# EAGLE board Evaluation_Board_v1.0 (EAGLE 9.6.2)
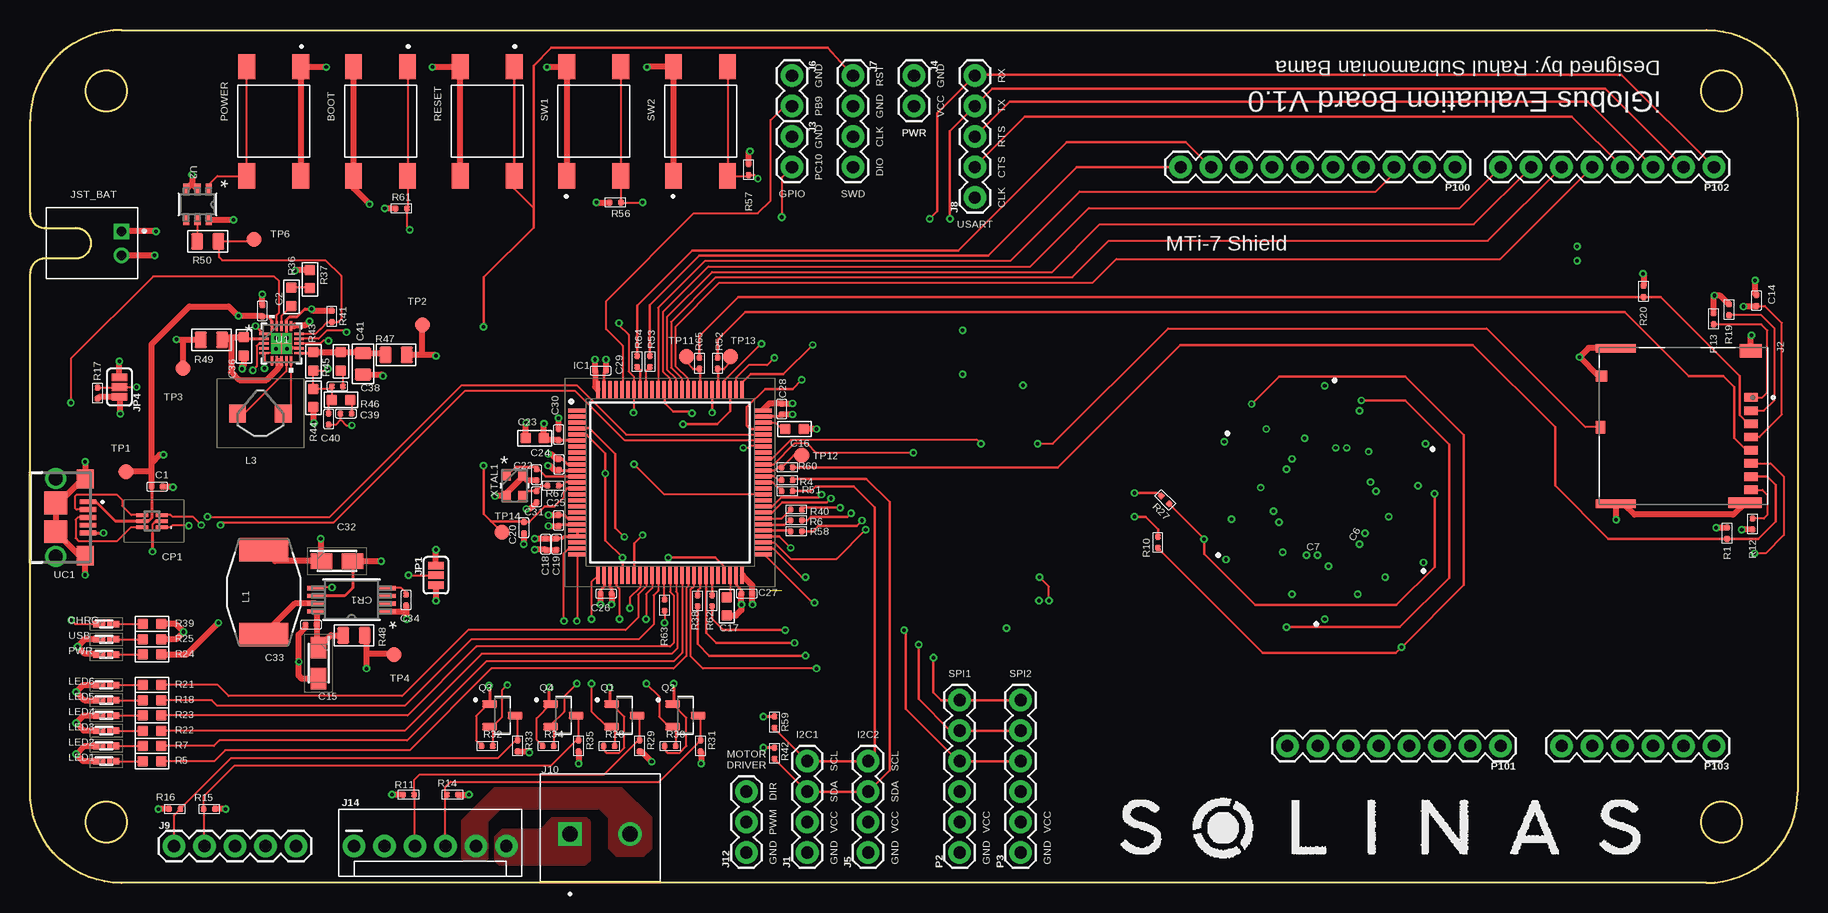
[diagram p3: board, top side]
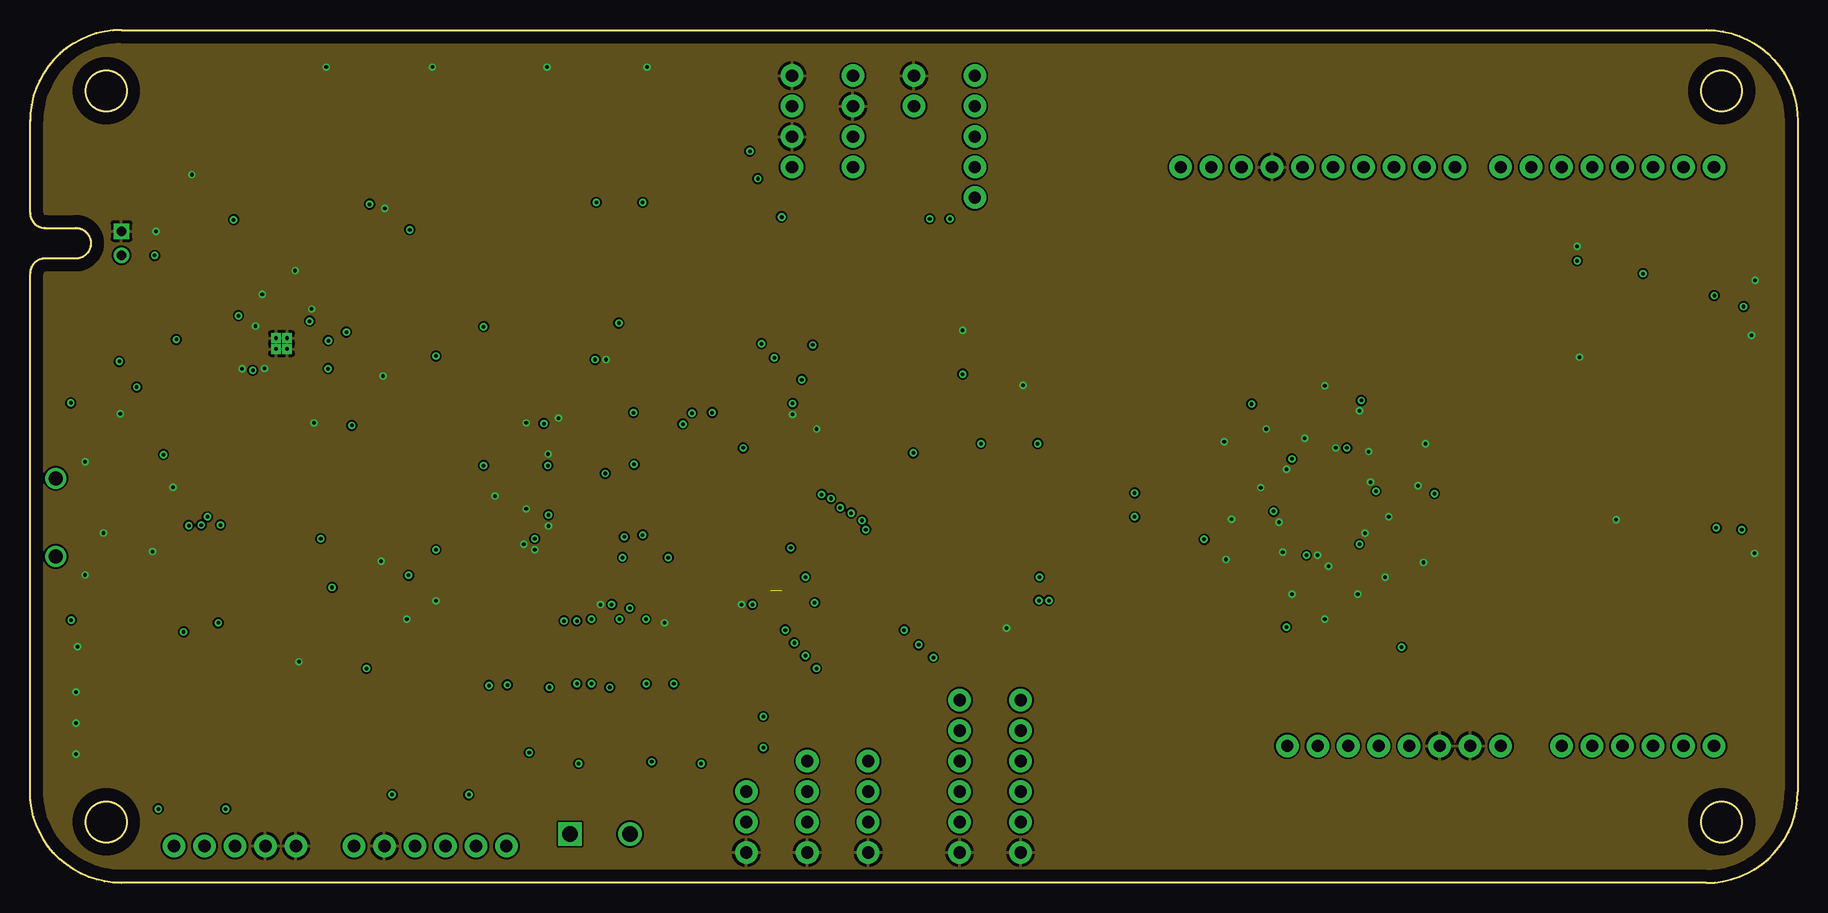
[diagram p4: board, inner layer Route2]
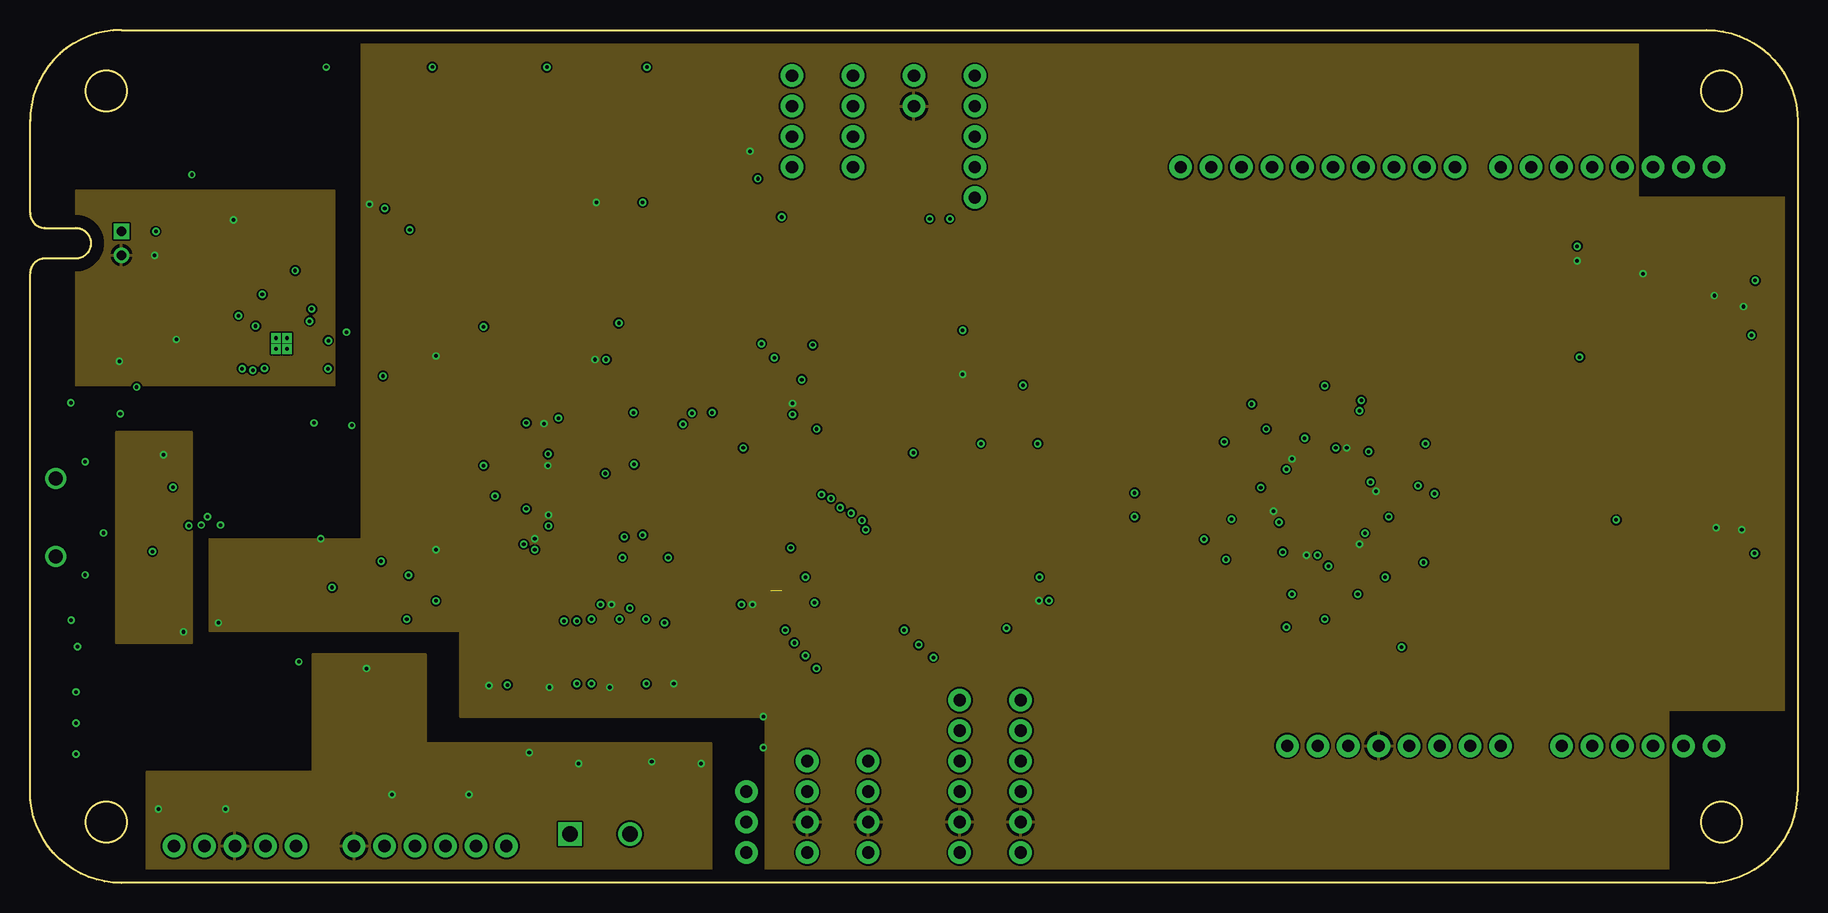
[diagram p5: board, inner layer Route15]
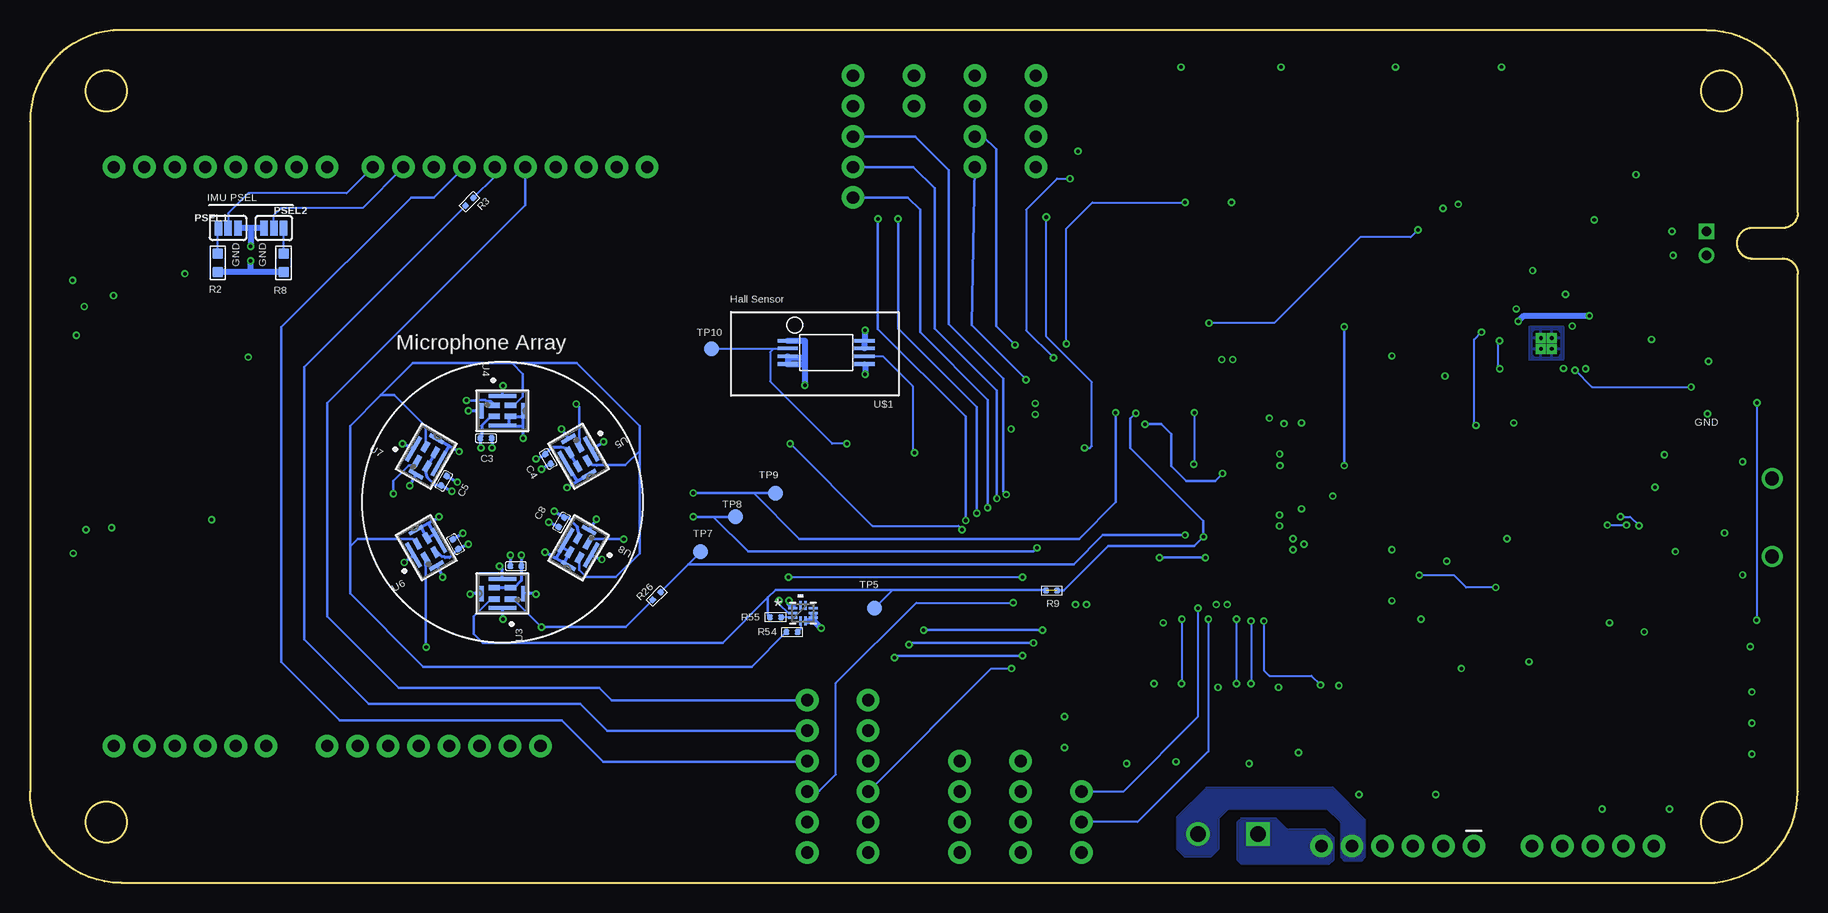
[diagram p6: board, bottom side, seen from below]

Size 147.32 x 71.12 mm. Coordinates in mm from the lower left corner, seen from the top.
Outline: 0,63.5 arc-90 7.62,71.12 139.7,71.12 arc-90 147.32,63.5 147.32,7.62 arc-90 139.7,0 7.62,0 arc-90 0,7.62 0,50.8 arc-90 1.27,52.07 3.81,52.07 arc90 5.08,53.34 arc90 3.81,54.61 1.27,54.61 arc-90 0,55.88 0,63.6
Outline: circle at 6.35,5.08 radius 1.7
Outline: circle at 6.35,66.04 radius 1.7
Outline: circle at 140.97,66.04 radius 1.7
Outline: circle at 140.97,5.08 radius 1.7
Copper layers (1+2*15+16): Top 0.035mm / dielectric 0.11mm / Route2 0.035mm / dielectric 0.4mm / Route15 0.035mm / dielectric 0.11mm / Bottom 0.035mm
Design rules "default *": minimum track width 6mil, minimum drill 0.3mm, track to track 6mil, track to pad 6mil, pad to pad 6mil, via to via 6mil, smd to smd 6mil, copper to edge 40mil, drill to drill 10mil, minimum pad ring 10mil, minimum via ring 6mil, stop-mask expansion 4mil, vias tented up to drill 0mil, thermal gap 10mil
Net classes: 1 Impedance Match: width 0.203 mm; 2 Power: width 0.152 mm; 3 High Power: width 0.762 mm; 4 Differential Impedance: width 0.152 mm, clearance 0.152 mm
tKeepout: area 138.2,2.3 to 143.7,7.8; area 138.2,63.3 to 143.7,68.8; area 3.6,63.3 to 9.1,68.8
bKeepout: area 3.6,2.3 to 9.1,7.8; area 138.2,2.3 to 143.7,7.8; area 138.2,63.3 to 143.7,68.8; area 3.6,63.3 to 9.1,68.8
tRestrict: area 3.6,2.3 to 9.1,7.8; area 138.2,2.3 to 143.7,7.8; area 138.2,63.3 to 143.7,68.8; area 3.6,63.3 to 9.1,68.8; area 3.6,2.3 to 9.1,7.8
bRestrict: area 138.2,2.3 to 143.7,7.8; area 138.2,63.3 to 143.7,68.8; area 3.6,2.3 to 9.1,7.8; area 3.6,63.3 to 9.1,68.8

## Footprints (pad centres in the part's own frame; a part is rotated, then mirrored left to right if it is on the bottom)
SW_1571563-2 = smd 2.1 x 1.4: 1 -4.55,2.25; 2 4.55,2.25; 3 -4.55,-2.25; 4 4.55,-2.25
C0402 = smd 0.5 x 0.5: 1 0,0.463; 2 0,-0.463
CAPPM3216X180N = smd 1.8 x 1.3: 1 -1.3,0; 2 1.3,0
C0603 = smd 0.889 x 0.889: 1 0,0.762; 2 0,-0.762
C0805 = smd 1.397 x 1.016: 1 0,0.889; 2 0,-0.889
LEDM106X25N = smd 1 x 0.55: 1 -0.6,0; 2 0.6,0
USBLC62P6 = smd 0.3 x 0.99: 1 -0.5,-0.805; 2 0,-0.805; 3 0.5,-0.805; 4 0.5,0.805; 5 0,0.805; 6 -0.5,0.805
TSSOP8_STM = smd 1.473 x 0.356: 1 -2.946,0.975; 2 -2.946,0.325; 3 -2.946,-0.325; 4 -2.946,-0.975; 5 2.946,-0.975; 6 2.946,-0.325; 7 2.946,0.325; 8 2.946,0.975
QFP50P1600X1600X160-100N = smd 1.475 x 0.3: 1 -7.738,6; 2 -7.738,5.5; 3 -7.738,5; 4 -7.738,4.5; 5 -7.738,4; 6 -7.738,3.5; 7 -7.738,3; 8 -7.738,2.5; 9 -7.738,2; 10 -7.738,1.5; 11 -7.738,1; 12 -7.738,0.5; 13 -7.738,0; 14 -7.738,-0.5; 15 -7.738,-1; 16 -7.738,-1.5; 17 -7.738,-2; 18 -7.738,-2.5; 19 -7.738,-3; 20 -7.738,-3.5; 21 -7.738,-4; 22 -7.738,-4.5; 23 -7.738,-5; 24 -7.738,-5.5; 25 -7.738,-6; 51 7.738,-6; 52 7.738,-5.5; 53 7.738,-5; 54 7.738,-4.5; 55 7.738,-4; 56 7.738,-3.5; 57 7.738,-3; 58 7.738,-2.5; 59 7.738,-2; 60 7.738,-1.5; 61 7.738,-1; 62 7.738,-0.5; 63 7.738,0; 64 7.738,0.5; 65 7.738,1; 66 7.738,1.5; 67 7.738,2; 68 7.738,2.5; 69 7.738,3; 70 7.738,3.5; 71 7.738,4; 72 7.738,4.5; 73 7.738,5; 74 7.738,5.5; 75 7.738,6 | smd 0.3 x 1.475: 26 -6,-7.738; 27 -5.5,-7.738; 28 -5,-7.738; 29 -4.5,-7.738; 30 -4,-7.738; 31 -3.5,-7.738; 32 -3,-7.738; 33 -2.5,-7.738; 34 -2,-7.738; 35 -1.5,-7.738; 36 -1,-7.738; 37 -0.5,-7.738; 38 0,-7.738; 39 0.5,-7.738; 40 1,-7.738; 41 1.5,-7.738; 42 2,-7.738; 43 2.5,-7.738; 44 3,-7.738; 45 3.5,-7.738; 46 4,-7.738; 47 4.5,-7.738; 48 5,-7.738; 49 5.5,-7.738; 50 6,-7.738; 76 6,7.738; 77 5.5,7.738; 78 5,7.738; 79 4.5,7.738; 80 4,7.738; 81 3.5,7.738; 82 3,7.738; 83 2.5,7.738; 84 2,7.738; 85 1.5,7.738; 86 1,7.738; 87 0.5,7.738; 88 0,7.738; 89 -0.5,7.738; 90 -1,7.738; 91 -1.5,7.738; 92 -2,7.738; 93 -2.5,7.738; 94 -3,7.738; 95 -3.5,7.738; 96 -4,7.738; 97 -4.5,7.738; 98 -5,7.738; 99 -5.5,7.738; 100 -6,7.738
1X04 = drill 1.016 pad 1.88: 1 0,0; 2 2.54,0; 3 5.08,0; 4 7.62,0
MOLEX_503398-1892 = smd 0.7 x 1.1: 1 -2.38,5.625; 2 -1.28,5.625; 3 -0.18,5.625; 4 0.92,5.625; 5 2.02,5.625; 6 3.12,5.625; 7 4.22,5.625; 8 5.32,5.625 | smd 0.9 x 0.93: 9 -4.17,-6.84 | smd 1.05 x 0.78: 10 0.095,-6.915 | smd 1.14 x 1.83: P1 -6.26,5.61 | smd 0.86 x 2.8: P2 6.4,5.125 | smd 0.7 x 3.33: P3 -6.48,-5.64; P4 6.48,-5.64
1X02 = drill 1.016 pad 1.88: 1 0,0; 2 2.54,0
1X05 = drill 1.016 pad 1.88: 1 0,0; 2 2.54,0; 3 5.08,0; 4 7.62,0; 5 10.16,0
CUI_TB001-500-02BE = drill 1.3 square: 1 0,0 | drill 1.3: 2 5,0
1X03 = drill 1.016 pad 1.88: 1 0,0; 2 2.54,0; 3 5.08,0
MOLEX-1X6 = drill 1.016 pad 1.88: 1 0,0; 2 2.54,0; 3 5.08,0; 4 7.62,0; 5 10.16,0; 6 12.7,0
SMT-JUMPER_3_1-NC_PASTE_SILK = smd 0.635 x 1.27: 1 -0.813,0; 2 0,0; 3 0.813,0
JST_S2B-PH-K-S(LF)(SN) = drill 0.8 square: 1 -1,0 | drill 0.8: 2 1,0
INDM9060X500N = smd 1.956 x 4.089: 1 -3.531,0; 2 3.531,0
CDRH3D16HPNP2R2NC = smd 1.4 x 1.5: 1 -1.9,0; 2 1.9,0
QFN10_1P8X1P4X0P5_STM = smd 0.762 x 0.203: 1 -0.851,0.4; 2 -0.851,0; 3 -0.851,-0.4; 6 0.851,-0.4; 7 0.851,0; 8 0.851,0.4 | smd 0.203 x 0.762: 4 -0.2,-0.648; 5 0.2,-0.648; 9 0.2,0.648; 10 -0.2,0.648
1X06 = drill 1.016 pad 1.88: 1 0,0; 2 2.54,0; 3 5.08,0; 4 7.62,0; 5 10.16,0; 6 12.7,0
1X10 = drill 1.016 pad 1.88: 1 0,0; 2 2.54,0; 3 5.08,0; 4 7.62,0; 5 10.16,0; 6 12.7,0; 7 15.24,0; 8 17.78,0; 9 20.32,0; 10 22.86,0
1X08 = drill 1.016 pad 1.88: 1 0,0; 2 2.54,0; 3 5.08,0; 4 7.62,0; 5 10.16,0; 6 12.7,0; 7 15.24,0; 8 17.78,0
SOT95P240X111-3N = smd 1.23 x 0.6: 1 -1.06,0.95; 2 -1.06,-0.95; 3 1.06,0
R0402 = smd 0.5 x 0.5: 1 0,0.463; 2 0,-0.463
R0603 = smd 0.889 x 0.889: 1 0,0.762; 2 0,-0.762
R0805 = smd 1.397 x 1.016: 1 0,0.889; 2 0,-0.889
B1,27 = smd 1.27 x 1.27: TP 0,0
QFN-20_UD_LIT = smd 0.805 x 0.199: 1 -1.452,0.8; 2 -1.452,0.4; 3 -1.452,0; 4 -1.452,-0.4; 5 -1.452,-0.8; 11 1.452,-0.8; 12 1.452,-0.4; 13 1.452,0; 14 1.452,0.4; 15 1.452,0.8 | smd 0.199 x 0.805: 6 -0.8,-1.452; 7 -0.4,-1.452; 8 0,-1.452; 9 0.4,-1.452; 10 0.8,-1.452; 16 0.8,1.452; 17 0.4,1.452; 18 0,1.452; 19 -0.4,1.452; 20 -0.8,1.452 | smd 1.75 x 1.75: 21 0,0 | drill 0.3 square: P$1 -0.457,0.457; P$2 0.457,0.457; P$3 -0.457,-0.457; P$4 0.457,-0.457
21-0114C_MXM = smd 0.927 x 0.508: 1 -1.264,0.95; 2 -1.264,0; 3 -1.264,-0.95; 4 1.264,-0.95; 5 1.264,0; 6 1.264,0.95
SPK0641HT4H-1_KNO = smd 0.457 x 0.94: 1 -0.475,-0.675; 2 -0.475,0.675; 3 0.475,0.675; 4 0.475,-0.675 | smd 1.295 x 0.33: 5 0,-1.712; 7 0,1.712 | smd 0.33 x 2.311: 6 -1.212,0; 8 1.212,0
A1162-8 = smd 0.3 x 1.7: 1 0,-3.2; 2 0.65,-3.2; 3 1.3,-3.2; 4 1.95,-3.2; 5 1.95,3.2; 6 1.3,3.2; 7 0.65,3.2; 8 0,3.2
2013499-1 = smd 0.4 x 1.35: 1 -1.3,4.825; 2 -0.65,4.825; 3 0,4.825; 4 0.65,4.825; 5 1.3,4.825 | smd 1.6 x 1.4: 6 -3.2,4.6; 7 3.2,4.6 | smd 1.9 x 1.9: 8 -1.2,2.15; 9 1.2,2.15 | drill 1.15 pad 1.75: 10 -3.255,2.15; 11 3.255,2.15
NX2520SA_NDK = smd 0.66 x 0.813: 1 -0.65,0.838; 2 -0.65,-0.838; 3 0.65,-0.838; 4 0.65,0.838

## Placement (x,y rotation side)
BOOT  1571563-2  [SW_1571563-2]  29.21,63.5 270 top
C1  100nf  [C0402]  10.59,33.05 270 top
C2  1uf  [C0402]  19.35,47.7 0 top
C3  100nf  [C0402]  109.32,37.08 270 bottom
C4  100nf  [C0402]  104.14,35.36 210 bottom
C5  100nf  [C0402]  112.83,33.53 330 bottom
C6  100nf  [C0402]  111.86,28.24 30 bottom
C7  100nf  [C0402]  106.83,26.42 90 bottom
C8  100nf  [C0402]  103.02,30.07 150 bottom
C14  100nf  [C0402]  143.87,48.56 180 top
C15  TPSA476K006R0800  [CAPPM3216X180N]  24.05,18.33 270 top
C16  2.2uf  [C0603]  63.7,37.85 270 top
C17  2.2uf  [C0603]  58.06,23.06 180 top
C18  100nf  [C0402]  42.98,28.24 180 top
C19  1uf  [C0402]  43.89,28.24 180 top
C20  100nf  [C0402]  41.15,29.62 180 top
C22  10pf  [C0402]  42.21,34.04 180 top
C23  10uf  [C0603]  42.06,37.08 90 top
C24  100nf  [C0402]  44.07,34.9 0 top
C25  100nf  [C0402]  44.04,30.23 180 top
C26  100nf  [C0402]  48.01,24.13 90 top
C27  100nf  [C0402]  59.74,24.13 90 top
C28  100nf  [C0402]  62.64,39.52 180 top
C29  100nf  [C0402]  47.55,42.72 270 top
C30  100nf  [C0402]  44.04,37.39 0 top
C31  10pf  [C0402]  42.21,32.21 180 top
C32  TPSA476K006R0800  [CAPPM3216X180N]  25.58,26.84 0 top
C33  100nf  [C0402]  23.42,21.53 270 top
C34  100nf  [C0402]  31.34,23.59 180 top
C36  10uf  [C0603]  17.83,44.75 180 top
C38  33pf  [C0402]  25.62,41.4 90 top
C39  330pf  [C0402]  26.33,39.14 90 top
C40  10pf  [C0402]  24.89,38.68 180 top
C41  22uf  [C0805]  27.74,43.29 180 top
CHRG  SML-P12MTT86R  [LEDM106X25N]  6.35,21.59 0 top
CP1  USBLC6-2P6  [USBLC62P6]  10.16,30.18 90 top
CR1  L6920D  [TSSOP8_STM]  26.8,23.61 180 top
IC1  STM32F446VET6  [QFP50P1600X1600X160-100N]  53.34,33.39 0 top
J1  I2C_1  [1X04]  64.77,2.54 90 top
J2  503398-1892  [MOLEX_503398-1892]  137.79,38.1 270 top
J3  [1X02]  63.5,62.23 270 top
J4  [1X02]  73.66,67.31 270 top
J5  I2C_2  [1X04]  69.85,2.54 90 top
J6  [1X02]  63.5,67.31 270 top
J7  SWD  [1X04]  68.58,67.31 270 top
J8  USART  [1X05]  78.74,57.15 90 top
J9  ENCODER_2  [1X05]  12,3.08 0 top
J10  TB001-500-02BE  [CUI_TB001-500-02BE]  45,4.08 0 top
J12  MOTOR_DRIVER_2  [1X03]  59.69,2.54 90 top
J14  MOTOR_DRIVER_1  [MOLEX-1X6]  27,3.08 0 top
JP1  JUMPER-SMT_3_1-NC_PASTE_SILK  [SMT-JUMPER_3_1-NC_PASTE_SILK]  33.83,25.65 90 top
JP4  JUMPER-SMT_3_1-NC_PASTE_SILK  [SMT-JUMPER_3_1-NC_PASTE_SILK]  7.47,41.35 90 top
JST_BAT  S2B-PH-K-S(LF)(SN)  [JST_S2B-PH-K-S(LF)(SN)]  7.62,53.34 270 top
L1  UP1B-100-R  [INDM9060X500N]  19.48,24.25 270 top
L3  CDRH3D16_HPNP-2R2NC  [CDRH3D16HPNP2R2NC]  19.19,39.15 180 top
LED1  SML-P12MTT86R  [LEDM106X25N]  6.35,10.16 0 top
LED2  SML-P12MTT86R  [LEDM106X25N]  6.35,11.43 0 top
LED3  SML-P12MTT86R  [LEDM106X25N]  6.35,12.7 0 top
LED4  SML-P12MTT86R  [LEDM106X25N]  6.35,13.97 0 top
LED5  SML-P12MTT86R  [LEDM106X25N]  6.35,15.24 0 top
LED6  SML-P12MTT86R  [LEDM106X25N]  6.35,16.51 0 top
MUX1  AS21P2TLRQ  [QFN10_1P8X1P4X0P5_STM]  82.91,22.5 0 bottom
P2  SPI_1  [1X06]  77.47,2.54 90 top
P3  SPI_2  [1X06]  82.55,2.54 90 top
P100  IMU_TR  [1X10]  118.75,59.69 180 top
P101  IMU_TL  [1X08]  122.56,11.43 180 top
P102  IMU_BR  [1X08]  140.34,59.69 180 top
P103  IMU_BL  [1X06]  140.34,11.43 180 top
POWER  1571563-2  [SW_1571563-2]  20.32,63.5 270 top
PSEL1  JUMPER-SMT_3_1-NC_PASTE_SILK  [SMT-JUMPER_3_1-NC_PASTE_SILK]  130.81,54.61 180 bottom
PSEL2  JUMPER-SMT_3_1-NC_PASTE_SILK  [SMT-JUMPER_3_1-NC_PASTE_SILK]  127,54.61 0 bottom
PWR  SML-P12MTT86R  [LEDM106X25N]  6.35,19.05 0 top
Q1  BSS138  [SOT95P240X111-3N]  49.53,13.97 0 top
Q2  BSS138  [SOT95P240X111-3N]  54.61,13.97 0 top
Q3  BSS138  [SOT95P240X111-3N]  39.37,13.97 0 top
Q4  BSS138  [SOT95P240X111-3N]  44.45,13.97 0 top
R1  47k 1/16W  [R0402]  141.43,29.16 180 top
R2  1K  [R0603]  131.67,51.71 0 bottom
R3  22R  [R0402]  110.69,56.79 315 bottom
R4  22R  [R0402]  63.09,33.58 270 top
R5  560R  [R0603]  10.16,10.16 90 top
R6  22R  [R0402]  63.86,30.23 270 top
R7  560R  [R0603]  10.16,11.43 90 top
R8  1K  [R0603]  126.19,51.71 0 bottom
R9  22R  [R0402]  62.18,24.38 270 bottom
R10  22R  [R0402]  93.98,28.4 180 top
R11  4.7K  [R0402]  31.55,7.37 270 top
R12  47k 1/16W  [R0402]  143.56,29.92 0 top
R13  47k 1/16W  [R0402]  140.31,47.04 180 top
R14  4.7K  [R0402]  35.2,7.37 90 top
R15  4.7K  [R0402]  14.94,6.17 90 top
R16  4.7K  [R0402]  12.06,6.17 270 top
R17  47k 1/16W  [R0402]  5.64,40.84 180 top
R18  560R  [R0603]  10.16,15.24 90 top
R19  47k 1/16W  [R0402]  141.58,47.8 180 top
R20  47k 1/16W  [R0402]  134.47,49.33 180 top
R21  560R  [R0603]  10.16,16.51 90 top
R22  560R  [R0603]  10.16,12.7 90 top
R23  560R  [R0603]  10.16,13.97 90 top
R24  560R  [R0603]  10.16,19.05 90 top
R25  560R  [R0603]  10.16,20.32 90 top
R26  22R  [R0402]  95.1,23.93 135 bottom
R27  22R  [R0402]  94.59,31.95 225 top
R28  10K 1/16W  [R0402]  48.26,11.43 270 top
R29  10K 1/16W  [R0402]  50.8,11.43 0 top
R30  10K 1/16W  [R0402]  53.34,11.43 270 top
R31  10K 1/16W  [R0402]  55.88,11.43 0 top
R32  10K 1/16W  [R0402]  38.1,11.43 270 top
R33  10K 1/16W  [R0402]  40.64,11.43 0 top
R34  10K 1/16W  [R0402]  43.18,11.43 270 top
R35  10K 1/16W  [R0402]  45.72,11.43 0 top
R36  1K  [R0603]  21.78,48.87 180 top
R37  1K  [R0603]  23.33,50.34 180 top
R38  22R  [R0402]  55.63,23.52 180 top
R39  560R  [R0603]  10.16,21.59 90 top
R40  22R  [R0402]  63.86,31.14 270 top
R41  47k 1/16W  [R0402]  25.15,47.24 0 top
R42  10K 1/16W  [R0402]  62.03,10.82 180 top
R43  324K  [R0603]  23.62,43.48 180 top
R44  105K  [R0603]  23.62,40.44 180 top
R45  121K  [R0603]  25.91,43.48 180 top
R46  15K  [R0603]  25.91,40.28 270 top
R47  0R  [R0805]  30.51,44.04 90 top
R48  0R  [R0805]  27,20.64 90 top
R49  0R  [R0805]  15.12,45.29 270 top
R50  0R  [R0805]  14.81,53.49 90 top
R51  22R  [R0402]  63.09,32.66 270 top
R52  22R  [R0402]  57.3,43.33 180 top
R53  22R  [R0402]  51.66,43.48 180 top
R54  22R  [R0402]  83.82,20.93 270 bottom
R55  22R  [R0402]  85.19,22.15 270 bottom
R56  47k 1/16W  [R0402]  48.77,56.74 270 top
R57  47k 1/16W  [R0402]  59.89,59.49 180 top
R58  22R  [R0402]  63.86,29.31 270 top
R59  10K 1/16W  [R0402]  62.03,13.41 180 top
R60  22R  [R0402]  63.09,34.65 270 top
R61  10K 1/16W  [R0402]  30.94,56.24 90 top
R62  22R  [R0402]  56.85,23.52 180 top
R63  10K 1/16W  [R0402]  52.88,23.16 180 top
R64  22R  [R0402]  50.6,43.48 180 top
R65  22R  [R0402]  55.78,43.33 180 top
R67  0R  [R0402]  43.59,33.12 90 top
RESET  1571563-2  [SW_1571563-2]  38.1,63.5 270 top
SW1  1571563-2  [SW_1571563-2]  46.99,63.5 90 top
SW2  1571563-2  [SW_1571563-2]  55.88,63.5 90 top
TP1  TPB1,27  [B1,27]  7.98,34.29 0 top
TP2  TPB1,27  [B1,27]  32.69,46.53 0 top
TP3  TPB1,27  [B1,27]  12.76,42.92 0 top
TP4  TPB1,27  [B1,27]  30.35,19.02 180 top
TP5  TPB1,27  [B1,27]  76.96,22.91 0 bottom
TP6  TPB1,27  [B1,27]  18.67,53.67 0 top
TP7  TPB1,27  [B1,27]  91.44,27.64 0 bottom
TP8  TPB1,27  [B1,27]  88.54,30.53 0 bottom
TP9  TPB1,27  [B1,27]  85.19,32.51 0 bottom
TP10  TPB1,27  [B1,27]  90.53,44.55 0 bottom
TP11  TPB1,27  [B1,27]  54.71,43.89 0 top
TP12  TPB1,27  [B1,27]  64.31,35.66 0 top
TP13  TPB1,27  [B1,27]  58.37,43.89 0 top
TP14  TPB1,27  [B1,27]  39.32,29.26 0 top
U1  LTC3558EUDPBF  [QFN-20_UD_LIT]  20.96,44.98 0 top
U2  MAX16054AZT+T  [21-0114C_MXM]  13.95,56.57 270 top
U3  SPK0641HT4H-1  [SPK0641HT4H-1_KNO]  107.95,24.13 90 bottom
U4  SPK0641HT4H-1  [SPK0641HT4H-1_KNO]  107.95,39.37 270 bottom
U5  SPK0641HT4H-1  [SPK0641HT4H-1_KNO]  101.6,35.56 210 bottom
U6  SPK0641HT4H-1  [SPK0641HT4H-1_KNO]  114.3,27.94 30 bottom
U7  SPK0641HT4H-1  [SPK0641HT4H-1_KNO]  114.3,35.56 330 bottom
U8  SPK0641HT4H-1  [SPK0641HT4H-1_KNO]  101.6,27.94 150 bottom
U$1  A1162  [A1162-8]  80.98,45.21 270 bottom
U$2  [SOLINAS-LOGO]  90.17,1.27 0 top
UC1  2013499-1  [2013499-1]  0,30.48 270 top
USB  SML-P12MTT86R  [LEDM106X25N]  6.35,20.32 0 top
XTAL1  NX2520SA-16MHZ  [NX2520SA_NDK]  40.39,33.12 0 top

## Tracks (layer width: path | path; a pad name or v marks a point on that pad's centre or on a via)
BAT
  Top 0.152: C36.2 17.97,45.38
  Top 0.254: 17.97,45.38 U1.2 | U1.8 20.86,43.53 U1.7
  Top 0.508: 20.67,42.96 20.67,43.53 20.86,43.53 20.86,43.14 20.67,42.96 | 20.67,42.96 20.67,42.88 19.73,41.94 17.45,41.94 16.76,42.62 16.76,45.36 16.09,45.36 R49.1 16.24,45.52 C36.2
BOOT0  (via drill 0.3)
  Top 0.152: IC1.61 52.85,32.39 v50.34,34.9 | BOOT.1 BOOT.2 31.46,56.3 R61.2 31.4,54.71 v31.65,54.46 | v49.07,46.69 49.07,46.53 49.88,45.72 49.88,42.65 50.34,42.2 IC1.94 50.29,41.08 v50.29,39.22
  Bottom 0.152: v31.65,54.46 32.26,53.85 36.47,53.85 43.64,46.69 v49.07,46.69 | v50.29,39.22 50.29,34.95 v50.34,34.9
BOOT1
  Top 0.152: R63.2 52.84,23.67 IC1.37
DAC_OUT1  (via drill 0.3)
  Top 0.152: IC1.29 48.84,24.82 49.12,24.54 v49.12,22
  Bottom 0.152: v49.12,22 49.12,10.97 55.02,5.08 J12.2
DAT1
  Top 0.152: J2.8 144.36,32.78 144.78,32.36 144.78,30.68 144.48,30.38 R12.1
DAT2
  Top 0.152: J2.1 144.37,40.48 144.78,40.89 144.78,46.08 144.28,46.58 R13.1
DAT3
  Top 0.152: J2.2 144.49,39.38 145.39,40.28 145.39,46.23 144.28,47.34 R19.1
ENCODER_1A
  Top 0.152: Q1.3 50.8,13.76 R29.1 50.7,11.89 47.85,9.04 32.46,9.04 32.01,8.59 R11.1 32.08,7.29 J14.3
ENCODER_1B
  Top 0.152: Q2.3 55.88,13.76 R31.1 52.43,8.43 35.05,8.43 34.62,8 34.62,7.49 R14.1 34.62,7.24 J14.4
ENCODER_2A
  Top 0.152: Q3.3 40.64,13.76 R33.1 40.49,11.89 39.01,10.41 16.76,10.41 R16.1 12,5.64 J9.1
ENCODER_2B
  Top 0.152: Q4.3 45.72,13.76 R35.1 45.52,11.89 43.43,9.8 17.07,9.8 14.47,7.21 R15.1 14.54,6.11 J9.2
EXTI0_IRQN  (via drill 0.3)
  Top 0.152: IC1.35 51.84,24.59 51.33,24.08 v51.33,22 | v51.36,16.61 52.43,15.54 52.43,13.87 53.27,13.02 Q2.2 53.8,12.77 R30.1
  Bottom 0.152: v51.33,22 51.33,16.64 v51.36,16.61
EXTI1_IRQN  (via drill 0.3)
  Top 0.152: IC1.24 45.57,27.92 44.92,27.92 44.48,27.48 44.48,21.86 v44.5,21.84 | v39.78,16.51 39.32,16.05 39.32,13.82 38.52,13.02 Q3.2 38.56,12.77 R32.1
  Bottom 0.152: v44.5,21.84 44.5,17.73 44.04,17.27 40.54,17.27 v39.78,16.51
EXTI2_IRQN  (via drill 0.3)
  Top 0.152: IC1.25 45.6,21.88 v45.57,21.84 | v45.57,16.61 44.5,15.55 44.5,14.28 43.39,13.16 Q4.2 43.64,12.77 R34.1
  Bottom 0.152: v45.57,21.84 v45.57,16.61
EXTI3_IRQN  (via drill 0.3)
  Top 0.152: IC1.26 46.79,25.1 v46.79,22 | v46.79,16.61 46.79,14.33 48.09,13.02 Q1.2 48.72,12.77 R28.1
  Bottom 0.152: v46.79,22 v46.79,16.61
EXTI8_IRQN  (via drill 0.3)
  Top 0.152: IC1.67 61.86,35.39 63.4,36.93 78.94,36.93 v79.25,36.63
  Bottom 0.152: v79.25,36.63 80.47,36.63 85.65,41.81 85.65,44.25 85.34,44.55 | 85.34,44.55 U$1.2 | TP10.TP 85.34,44.55
EXTI11_IRQN  (via drill 0.3)
  Top 0.152: SW1.4 SW1.3 49.24,56.75 R56.1 v51.05,56.74 | IC1.79 57.81,41.16 57.81,41.83 60.94,44.96 v60.96,44.96
  Bottom 0.152: v51.05,56.74 58.78,56.74 60.96,54.56 v60.96,44.96
EXTI14_IRQN  (via drill 0.3)
  Top 0.152: IC1.53 62.03,28.39 63.4,27.03 67.21,27.03 v69.65,29.46 | v83.97,36.63 85.24,36.63 94.84,46.23 121.39,46.23 129.61,38.01 J2.10
  Bottom 0.152: v83.97,36.63 77.11,29.77 69.95,29.77 v69.65,29.46
EXTI15_IRQN  (via drill 0.3)
  Top 0.152: SW2.4 SW2.3 59.82,58.95 R57.1 60.36,59.02 v60.66,58.73 | IC1.77 58.84,42.13 59.89,43.18 61.42,43.18 v62.03,43.79
  Bottom 0.152: v60.66,58.73 61.72,58.73 64.31,56.13 64.31,46.08 v62.03,43.79
FMPI2C1_SCL
  Top 0.203: R51.1 65.07,32.66 65.46,33.06 68.65,33.06 70.41,31.29 70.41,10.72 J5.4 J1.4 62.03,12.9 R59.1
FMPI2C1_SDA
  Top 0.203: R4.1 63.56,33.69 69.7,33.69 71.63,31.76 71.63,9.4 J5.3 J1.3 R42.1
GND  (via drill 0.3)
  Top 0.152: 51.44,68.05 v51.41,68.02 | U1.5 20.16,44.18 U1.21 20.96,45.23 20.41,45.78 U1.1 19.45,45.78 19.44,45.79 | J2.6 145.06,34.98 146.15,33.88 146.15,29.01 144.63,27.48 v143.71,27.48 | 132.16,31.6 132.18,31.6 | C25.1 | CP1.2 10.93,30.21 10.5,30.21 10.21,29.92 10.21,29.16 | v13.49,59.05 13.54,59 | C18.1 | 22.68,68.02 22.6,68.02 POWER.1 | R63.1 v52.88,21.69
  Top 0.254: C25.1 44.17,29.89 IC1.20 | IC1.10 45.54,34.95 44.76,34.95 44.35,35.36 C24.1 | IC1.99 47.84,42.55 C29.1 | IC1.74 61.09,38.91 62.48,38.91 C28.1 | IC1.49 58.86,25.63 58.86,24.85 59.28,24.43 C27.1 | IC1.27 47.85,25.64 47.85,24.75 47.54,24.43 C26.1 | CR1.6 26.21,23.94 26.88,24.6 C32.2 | U1.12 21.36,44.58 20.98,44.96 | 20.98,44.96 U1.21 | 20.98,44.96 21.36,45.34 U1.17 21.36,46.93 21.67,47.23 22.28,47.23 22.9,47.85 v23.47,47.85 | v10.21,27.64 10.21,29.16 | UC1.5 v6.12,29.18 | v18.8,46.43 19.44,45.79 | J2.P4 132.44,31.6 | J2.P4 132.18,31.6 | J2.P4 132.18,31.57 | U1.5 19.53,44.16 v19.53,42.9
  Top 0.508: JP1.1 v33.83,23.52 | v7.52,39.12 7.47,39.17 JP4.1 5.8,40.54 R17.1 | v10.49,54.33 JST_BAT.1 | v24.69,68.02 22.68,68.02 | POWER.1 POWER.2 | U2.2 13.54,58.25 13.54,58.37 | U2.3 13.54,58.37 | 13.54,59 13.54,58.37 | RESET.4 RESET.3 35.82,68.02 v33.53,68.02 | SW1.1 SW1.2 43.11,68.05 v43.08,68.02 | SW2.1 SW2.2 51.44,68.05 | C41.1 29.28,42.4 v29.41,42.27 | R44.1 23.62,38.41 v23.67,38.35 | R37.2 22.15,51.11 v22.1,51.05 | C1.1 11.86,33.05 v11.91,32.99 | C36.1 17.83,43.22 17.68,43.07 v17.68,42.88 | C32.2 29.25,26.84 v29.26,26.82 | C33.2 22.96,21.27 22.39,20.7 22.39,18.45 | USB.1 4.57,20.32 v3.96,19.71 4.57,19.1 5.7,19.1 PWR.1 | LED6.1 4.42,16.51 v3.83,15.93 4.52,15.24 LED5.1 | LED4.1 4.47,13.97 v3.83,13.34 4.47,12.7 LED3.1 | LED2.1 4.52,11.43 v3.83,10.74 4.42,10.16 LED1.1 | C22.1 41.42,33.57 XTAL1.4 41.04,33.8 39.74,32.5 XTAL1.2 39.71,32.26 v38.76,32.26 | C31.1 41.66,31.19 v41.35,31.19 | UC1.6 4.6,33.88 | v4.6,25.68 UC1.7 4.15,27.28 UC1.9 UC1.8 2.39,31.68 4.6,33.88 | v4.6,35.13 4.6,33.88 | 132.44,31.6 132.83,31.6 133.72,30.71 141.93,30.71 J2.P2 | v132.18,30.28 132.18,31.57 132.16,31.6 | J2.P3 132.13,44.6 129.9,44.6 v129.13,43.84 130.7,42.27 J2.9 | J2.P1 143.41,45.62 v143.46,45.67 | C14.2 143.76,49.13 v143.76,50.24 | v65.56,37.85 C16.1 | C28.1 v63.55,39.06 | C29.1 v48.01,43.64 | C30.1 v44.04,38.76 | C23.1 41.3,38.3 v41.35,38.35 | v43.18,35.76 43.44,35.76 43.84,35.36 C24.1 | v43.2,29.77 C25.1 | C18.1 v42.06,27.79 | C18.1 C19.1 | C20.1 v41.15,28.25 | v47.55,23.22 v47.54,23.22 C26.1 | C27.1 v59.28,23.22 59.28,22.76 58.83,22.3 C17.1 | C15.2 22.64,17.03 22.39,17.29 22.39,18.45 | v22.4,18.44 22.39,18.45 | C34.1 31.34,22.45 | 31.34,22.45 31.34,22.05 v31.39,22
  Top 0.508: 31.34,22.45 31.16,22.64 CR1.1 | R61.1 v29.57,56.24 | C2.1 v19.36,49.07 | v23.47,47.85 23.62,47.7 R41.1
  Bottom 0.152: MUX1.7 82.06,22.4 | MUX1.6 82.06,21.91 82,21.86 | MUX1.5 82.6,21.86
  Bottom 0.254: C8.1 v104.09,30.07 | v107.29,27.33 C7.1 | v111.25,29.16 C6.1 | C5.1 v111.71,33.43 | C3.1 v108.81,36.27 | C4.1 v104.7,34.49 | U3.6 107.95,22.05 v107.9,22 | U3.7 110.59,24.13 v110.64,24.08 | U3.8 107.95,26.16 v108.2,26.42 | v105.16,24.08 105.21,24.13 U3.5 | U4.7 106.24,38.86 | 106.24,38.86 106.24,38.1 | 106.24,38.1 106.24,37.1 v106.22,37.08 | U4.8 107.89,38.1 107.44,38.1 | 107.44,38.1 106.24,38.1 | 107.44,38.1 107.44,38.73 U4.3 106.27,38.9 106.24,38.86 | U4.6 v107.9,41.45 | U4.5 v110.8,39.37 | U5.5 v103.02,37.85 | U5.6 v99.52,36.78 | U5.7 101.72,33.48 | 101.72,33.48 v102.56,32.97 | U5.8 101.72,33.48 | U7.7 112.38,36.44 | 112.38,36.44 v111.56,35.97 | U7.8 112.38,36.44 | U7.6 v116.28,36.63 | U7.5 v115.67,33.12 | U6.7 114.73,29.67 | 114.73,29.67 114.14,30.01 | 114.14,30.01 v113.23,30.53 | U6.8 113.58,29.08 | 113.58,29.08 114.14,30.01 | 114.73,29.67 U6.3 113.58,29.08 | U6.6 v116.13,26.72 | U6.5 v112.93,25.5 | U8.7 102.86,26.69 | 102.86,26.69 103.51,27.07 | 103.51,27.07 v104.39,27.58 | U8.8 102.97,28.01 | 102.97,28.01 103.51,27.07 | 102.97,28.01 U8.3 102.86,26.69 | U8.6 100.47,27.25 v99.67,26.98 | U8.5 v100.13,30.33
  Bottom 0.508: PSEL2.1 128.93,54.61 | 128.93,54.61 PSEL1.1 | 128.93,54.61 v128.93,53.09 | v81.38,21.23 82,21.86 | 82.6,21.86 82,21.86 | 82,21.86 82,22.35 82.06,22.4 | U$1.1 82.75,45.21 82.75,43.79 | 82.75,43.79 82.75,43.33 | 82.75,43.33 v82.75,41.5 | 82.75,43.33 82.82,43.26 U$1.4 U$1.3 84.05,43.79 82.75,43.79 | U$1.7 U$1.8 77.72,45.26 v77.72,46.08
  pour Route2 (isolate 0.127): -1.27,67.67 -1.27,-2.13 148.59,-2.13 148.59,67.31 142.75,73.15 4.22,73.15
  pour Bottom: 19.52,46.37 22.39,46.37 22.39,43.65 19.52,43.65
GPIO_PA10  (via drill 0.3, 0.35)
  Top 0.152: J3.2 62.64,58.83 v62.64,55.52 | IC1.69 61.05,36.42 60.05,36.42 59.89,36.27 v59.44,36.27
  Bottom 0.152: v59.44,36.27 58.98,36.27 58.83,36.42 58.83,41.76 62.64,45.57 v62.64,55.52
GPIO_PB9
  Top 0.152: IC1.96 49.38,41.17 49.38,44.8 48.01,46.17 48.01,48.51 55.32,55.83 60.66,55.83 61.72,56.9 61.72,63.6 62.89,64.77 J6.2
I2C1_SCL
  Top 0.203: R53.2 51.66,48.18 55.78,52.3 79.86,52.3 87.25,59.69 P100.10
I2C1_SDA
  Top 0.203: R64.2 50.6,48.16 55.17,52.73 77.37,52.73 86.41,61.77 96.32,61.77 98.4,59.69 P100.9
I2S1_CK  (via drill 0.3)  (1 unrouted)
  Top 0.203: v49.53,28.85 48.77,29.62 48.77,35.78 46.6,37.95 45.66,37.95 IC1.4 | IC1.89 52.88,41.09 52.88,40.04 53.6,39.32 55.02,39.32 v55.17,39.17
  Bottom 0.203: TP5.TP 75.44,24.43 | 75.44,24.43 85.19,24.43 85.84,23.79 | R55.2 85.84,22.33 85.84,23.79 | 85.84,23.79 89.61,20.02 109.58,20.02 110.34,20.78 110.34,22.23 108.92,23.66 U3.2 | v55.17,39.17 55.63,38.71 55.63,36.27 49.53,30.18 v49.53,28.85 50.29,28.09 57.45,28.09 61.16,24.38 R9.1 | 75.44,24.43 62.69,24.43 R9.2
I2S1_SD  (via drill 0.3)
  Top 0.203: IC1.32 50.34,28.29 v51.05,29.01
  Bottom 0.203: 92.46,26.57 91.42,27.61 TP7.TP | v51.05,29.01 57.91,29.01 60.35,26.57 92.46,26.57 | 92.46,26.57 R26.2
I2S2_SD  (via drill 0.3)
  Top 0.203: IC1.54 62.45,28.89 v63.4,27.94 | v92.05,30.53 92.96,30.53 94.03,29.46 94.03,28.91 R10.2
  Bottom 0.203: 90.37,30.53 87.48,27.64 63.7,27.64 v63.4,27.94 | v92.05,30.53 90.37,30.53 | TP8.TP 90.37,30.53
I2S3_SD  (via drill 0.3)
  Top 0.203: IC1.81 56.84,39.83 56.84,39.82 v56.84,39.22 | R27.2 94.03,32.51 v92.05,32.51
  Bottom 0.203: v56.84,39.22 56.84,31.75 59.89,28.7 83.21,28.7 87.02,32.51 | 87.02,32.51 TP9.TP | v92.05,32.51 87.02,32.51
I2SX_CK
  Bottom 0.203: 120.65,28.04 120.02,28.67 115.86,28.67 115.82,28.69 115.75,28.67 115.43,28.67 U6.2 | 96.52,36.02 96.52,38.1 101.75,43.33 107.14,43.33 | 96.52,36.02 96.52,27.48 98.5,25.5 100.95,25.5 101.55,26.1 101.55,26.23 101.54,26.24 101.54,26.25 101.54,27.1 U8.2 | 107.14,43.33 115.42,43.33 118.08,40.66 | 118.08,40.66 120.65,38.1 120.65,28.04 | 120.65,28.04 120.65,24.13 114.55,18.03 87.17,18.03 R54.2 | 118.08,40.66 116.97,40.66 114.35,38.05 114.35,37.27 114.36,37.26 114.36,37.25 114.36,36.4 U7.2 | 107.14,43.33 106.25,42.45 106.25,40.57 106.98,39.84 U4.2 | 96.52,36.02 97.71,34.83 100.05,34.83 100.08,34.81 100.15,34.83 100.47,34.83 U5.2
IMU_PSEL0
  Bottom 0.152: P100.2 119.61,56.29 126.4,56.29 127.04,55.64 127.04,54.65 PSEL2.2
IMU_PSEL1
  Bottom 0.152: P100.1 120.93,57.51 129.14,57.51 130.81,55.84 PSEL1.2
IMU_RESET
  Top 0.152: IC1.85 54.84,42.04 53.77,43.11 53.77,46.36 57.45,50.04 88.54,50.04 90.53,52.02 122.5,52.02 P102.5
IMU_SYNC_IN
  Top 0.152: IC1.88 53.34,42.04 52.73,42.65 52.73,47.6 56.54,51.41 83.36,51.41 88.24,56.29 119.15,56.29 P102.8
IMU_SYNC_OUT
  Top 0.152: IC1.87 53.84,42.04 53.08,42.81 53.08,47.19 56.84,50.95 85.19,50.95 89.15,54.91 120.32,54.91 P102.7
IMU_SYNC_PPS
  Top 0.152: IC1.86 54.34,42.04 53.43,42.96 53.43,46.77 57.15,50.49 86.87,50.49 89.92,53.54 121.49,53.54 P102.6
IO_LED1
  Top 0.152: IC1.41 54.84,24.74 54.69,24.59 54.69,18.92 53.65,17.88 38.46,17.88 31.65,11.07 16.26,11.07 15.34,10.16 R5.2
IO_LED2
  Top 0.152: IC1.40 54.34,19.19 53.65,18.49 38.03,18.49 31.42,11.89 15.77,11.89 15.32,11.43 R7.2
IO_LED3
  Top 0.152: IC1.39 53.84,24.28 53.95,24.17 53.95,19.56 53.49,19.1 37.63,19.1 31.23,12.7 R22.2
IO_LED4
  Top 0.152: IC1.38 53.34,24.28 53.65,23.98 53.65,20.02 53.34,19.71 37.2,19.71 31.46,13.97 R23.2
IO_LED5
  Top 0.152: IC1.36 52.34,24.35 51.97,23.98 51.97,21.54 50.75,20.32 36.78,20.32 31.25,14.78 15.62,14.78 15.16,15.24 R18.2
IO_LED6
  Top 0.152: IC1.34 51.34,24.72 50.67,24.05 50.67,22.12 49.63,21.08 36.5,21.08 31.02,15.6 16.56,15.6 15.65,16.51 R21.2
IO_MAG_DIAG  (via drill 0.3)
  Top 0.152: IC1.66 61.97,34.89 63.7,36.63 64.77,36.63 65.53,35.87 v73.61,35.87
  Bottom 0.152: v73.61,35.87 73.76,36.02 73.76,41.42 76.25,43.91 U$1.6
IO_MOTOR_DIR  (via drill 0.3)
  Top 0.152: IC1.33 50.84,24.65 49.99,23.8 v49.99,22.91
  Bottom 0.152: v49.99,22.91 49.99,13.87 56.24,7.62 J12.3
IO_MUX_MIC  (via drill 0.3)
  Top 0.152: IC1.52 61.92,27.89 64.31,25.5 v64.62,25.5 | v84.91,23.54 84.91,24.72 v84.12,25.5
  Bottom 0.152: v84.12,25.5 v64.62,25.5 | MUX1.2 83.81,22.45 84.11,22.45 84.91,23.25 v84.91,23.54
MODE  (via drill 0.3)
  Top 0.152: U1.3 19.09,44.98 18.88,44.77 18.88,43.06 v18.57,42.75 | JP4.2 7.62,41.35 | 7.62,41.35 v8.89,41.35 | R17.2 7.57,41.31 7.62,41.35
  Bottom 0.152: v18.57,42.75 17.17,41.35 v8.89,41.35
MOTOR+
  pour Top (no thermals): 39.37,4.45 38.73,3.81 38.73,1.91 39.08,1.56 46.33,1.56 46.67,1.91 46.67,5.08 46.35,5.4 43.5,5.4 42.55,4.45
  pour Bottom (no thermals): 39.41,4.48 38.73,3.81 38.73,1.91 39.08,1.56 46.33,1.56 46.67,1.91 46.67,5.08 46.35,5.4 43.5,5.4 42.58,4.48
MOTOR-
  pour Top (no thermals): 38.1,2.02 37.93,1.85 36.21,1.85 36.03,2.03 36.03,5.23 38.73,7.94 49.28,7.94 51.75,5.46 51.75,2.86 51.12,2.22 48.9,2.22 48.26,2.86 48.26,5.4 47.47,6.18 39.2,6.18 38.1,5.08
  pour Bottom (no thermals): 38.1,2.17 37.78,1.85 36.36,1.85 36.03,2.18 36.03,5.23 38.73,7.94 49.28,7.94 51.75,5.46 51.75,2.86 51.12,2.22 48.9,2.22 48.26,2.86 48.26,5.4 47.47,6.18 39.2,6.18 38.1,5.08
N$1
  Top 0.152: C34.2 31.34,24.18 30.94,24.59 CR1.4
N$2
  Top 0.254: CR1.7
  Top 0.508: L1.2 22.06,23.3 CR1.7
N$3
  Top 0.152: UC1.2 3.87,31.13 3.79,31.22 3.79,32.28 3.89,32.38 7.24,32.38 7.68,31.95 7.68,31.44 8.44,30.68 CP1.4
N$4
  Top 0.152: UC1.3 3.99,30.48 3.81,30.3 3.81,28.75 4.04,28.52 7.29,28.52 8.44,29.68 CP1.6
N$5
  Top 0.152: U1.18 20.96,47.29 R36.1
N$6
  Top 0.152: R37.1 23.28,49.63 R36.2
N$7
  Top 0.152: CHRG.2 R39.1
N$8  (via drill 0.3)
  Top 0.152: v25.17,24.64 23.9,24.64 CR1.5 | v31.55,25.65 JP1.2
  Bottom 0.152: v25.17,24.64 27.64,24.64 28.65,25.65 v31.55,25.65
N$9
  Top 0.152: R45.1 26.08,42.55 C38.2
N$10
  Top 0.152: IC1.48 58.34,24.1 C17.2
N$11
  Top 0.152: U2.5 13.96,53.52 R50.1
N$12  (via drill 0.3)
  Top 0.152: C40.2 24.89,40.03 R46.2 25.15,41.39 C38.1 24.95,41.2 R44.2 R43.1 24.69,42.72 v24.84,42.88 | v24.87,45.21 24.43,45.21 24.2,44.98 U1.13
  Bottom 0.152: v24.84,42.88 24.99,43.03 24.99,45.09 v24.87,45.21
N$13
  Top 0.152: R46.1 26.8,40.16 C39.2
N$14
  Top 0.152: IC1.73 62.09,38.39 62.64,37.85 C16.2
N$15
  Top 0.152: U2.1 14.9,58.24 15.62,58.95 POWER.4 POWER.3
N$16
  Bottom 0.152: R2.1 131.67,54.56 PSEL1.3
N$17
  Bottom 0.152: MUX1.4 83.11,21.18 R54.1
N$18
  Top 0.152: U1.10 21.74,43.51 21.74,39.8 L3.1
N$19
  Top 0.203: XTAL1.3 41.42,32.67 C31.2 42.65,33.1 43.26,33.1 43.23,33.12 R67.1
N$20
  Bottom 0.152: R8.1 PSEL2.3
N$21  (via drill 0.3)
  Top 0.152: C39.1 25.87,38.58 | 25.87,38.58 25.5,38.22 C40.1 | 25.87,38.58 25.93,38.58 26.36,38.15 v26.82,38.15 | U1.14 24.05,45.38 24.72,46.05 26.24,46.05 v26.36,45.92
  Bottom 0.152: v26.82,38.15 26.98,38.3 26.98,45.31 v26.36,45.92
N$22
  Top 0.152: U1.9 21.37,42.67 17.84,39.15 L3.2
N$23
  Top 0.152: LED1.2 R5.1
N$24
  Bottom 0.152: MUX1.3 83.8,22.15 R55.1
N$25
  Top 0.152: LED2.2 R7.1
N$26
  Top 0.203: R51.2 61.9,33.39 IC1.63
N$27
  Top 0.152: LED5.2 R18.1
N$28
  Top 0.152: IC1.57 62.65,30.39 R40.2
N$29
  Top 0.152: LED6.2 R21.1
N$30
  Top 0.203: IC1.43 55.84,24.59 55.69,24.43 55.69,24.04 R38.2
N$31
  Top 0.152: LED3.2 R22.1
N$32  (via drill 0.3)
  Top 0.203: v101.8,39.93 104.09,42.22 114.61,42.22 119.48,37.34 119.48,24.84 v114.3,19.66 113.81,19.17 102.74,19.17 R10.1
  Bottom 0.203: U5.1 101.53,37.02 101.54,37.05 101.54,37.06 101.54,39.67 v101.8,39.93 | U6.1 114.37,26.48 114.36,26.45 114.36,26.44 114.36,19.72 v114.3,19.66
N$33
  Top 0.152: LED4.2 R23.1
N$34
  Top 0.203: IC1.80 57.34,42.83 R52.1 57.8,42.87 58.37,43.43 TP13.TP
N$35
  Top 0.152: PWR.2 R24.1
N$36
  Top 0.152: IC1.92 51.34,42.7 R53.1
N$37
  Top 0.152: USB.2 R25.1
N$38
  Top 0.203: R4.2 62.34,33.58 61.98,33.94 61.12,33.94 IC1.64
N$39
  Top 0.203: R6.2 63.23,30.23 62.85,29.85 61.12,29.85 IC1.56
N$40
  Top 0.203: IC1.55 63.31,29.39 R58.2
N$41
  Bottom 0.203: R3.1 108.58,58.9 P100.5
N$42
  Top 0.203: IC1.65 62.07,34.39 62.33,34.65 R60.2 63.65,35.66 TP12.TP
N$43  (via drill 0.3)
  Top 0.203: R27.1 97.84,28.7 v97.84,28.65 97.84,27.43 102.11,23.17 113.84,23.17 117.04,26.36 v117.04,32.46
  Bottom 0.203: U8.1 100.78,28.29 100.38,28.69 97.88,28.69 v97.84,28.65 | U7.1 115.44,34.82 115.75,34.82 117.04,33.52 v117.04,32.46
N$44
  Top 0.203: IC1.45 R62.2
N$46
  Top 0.203: IC1.93 50.84,42.78 R64.1
N$47
  Top 0.203: IC1.83 55.84,42.81 R65.1 55.28,42.87 54.71,43.43 TP11.TP
N$49  (via drill 0.3)
  Top 0.203: v110.95,40.23 114.61,40.23 118.26,36.58 118.26,25.45 114.15,21.34 v104.7,21.34
  Bottom 0.203: U4.1 108.94,40.16 109.28,40.16 109.39,40.27 109.93,40.27 109.97,40.23 v110.95,40.23 | U3.1 107.01,23.66 v104.7,21.35 v104.7,21.34 97.69,21.34 R26.1
OSC_IN
  Top 0.203: XTAL1.1 40.46,34.68 42.03,34.68 C22.2 42.37,34.5 42.98,33.88 IC1.12
OSC_OUT
  Top 0.203: IC1.13 45.57,33.43 44.65,33.43 44.35,33.12 R67.2
OTG_FS_DM  (via drill 0.3)
  Top 0.152: IC1.70 61.04,36.93 49.53,36.93 45.41,41.05 36.27,41.05 25.3,30.07 16.1,30.07 v15.88,29.84 | CP1.3 11.73,30.68 11.88,30.52 13.6,30.52 v14.28,29.84
  Bottom 0.152: v15.88,29.84 v14.28,29.84
OTG_FS_DP  (via drill 0.3)
  Top 0.152: IC1.71 49.67,37.39 45.56,41.5 35.96,41.5 24.99,30.53 v14.78,30.53 | v13.23,29.79 13.2,29.83 11.88,29.83 11.73,29.68 CP1.1
  Bottom 0.152: v14.78,30.53 13.97,30.53 v13.23,29.79
OUT
  Top 0.508: R48.1 25.07,20.64 C15.1 23.88,19.8 C33.1 23.88,22.61 CR1.8
PMIC_CHRG  (via drill 0.3)
  Top 0.152: U1.19 20.56,47.36 20.75,47.55 20.75,50.16 20.34,50.57 10.26,50.57 3.4,43.71 v3.4,40.03 | v3.43,21.92 3.76,21.59 CHRG.1
  Bottom 0.152: v3.4,40.03 3.4,21.95 v3.43,21.92
PMIC_EN2
  Top 0.152: U1.15 23.78,45.78 24.21,46.2 24.79,46.78 R41.2 25.68,46.78 25.72,46.82 25.93,47.03 25.93,50.63 24.62,51.93 16,51.93 15.76,52.17 15.76,53.43 R50.2 18.5,53.49 TP6.TP
RESET  (via drill 0.3)
  Top 0.203: J7.1 66.5,69.63 43.45,69.63 41.96,68.14 41.96,56.29 | RESET.1 RESET.2 | RESET.2 40.35,58.38 40.23,58.27 40.23,58.83 RESET.2 | RESET.2 40.35,57.9 41.96,56.29 | 41.96,56.29 41.96,54.66 37.8,50.49 v37.8,46.38 | v37.8,34.8 37.8,30.79 38.41,30.18 38.43,30.15 | IC1.14 44.74,32.89 44.51,32.66 44.51,32.2 43.68,31.38 42.9,31.38 41.6,30.08 C20.2 41.08,30.15 38.43,30.15 | TP14.TP 38.43,30.15
  Bottom 0.203: v37.8,46.38 v37.8,34.8
SDIO_CK
  Top 0.203: R52.2 57.3,45.31 59.59,47.6 132.89,47.6 138.23,42.27 141.12,42.27 142.04,41.35 142.04,37.08 143.04,36.08 J2.5
SDIO_CMD
  Top 0.203: R65.2 55.78,45.62 59.02,48.86 R20.1 135.9,48.86 142.48,42.28 142.48,39.01 143.2,38.28 J2.3
SDIO_D0
  Top 0.203: R60.1 85.65,34.65 95.86,44.86 120.24,44.86 127.1,38 127.1,33.12 131.52,28.7 R1.1 144.01,28.7 145.47,30.15 145.47,33.2 144.78,33.88 J2.7
SPI4_CS1  (via drill 0.3)
  Top 0.152: IC1.42 55.34,24.74 55.03,24.43 55.03,18.93 56.08,17.88 v65.53,17.88
  Bottom 0.152: v65.53,17.88 67.21,17.88 P2.3
SPI4_CS2  (via drill 0.3)
  Top 0.152: v65.38,23.37 65.23,23.37 61.2,27.39 IC1.51
  Bottom 0.152: v65.38,23.37 73.46,23.37 80.16,16.66 80.16,9.04 81.53,7.67 82.5,7.67 P3.3
SPI4_MISO  (via drill 0.3)
  Top 0.203: v74.07,19.86 74.07,15.34 76.71,12.7 P2.5 P3.5 | IC1.44 56.34,20.85 57.18,20.02 v63.7,20.02
  Bottom 0.203: P3.5 99.21,12.7 101.45,14.94 119.08,14.94 124.46,20.32 124.46,43.03 R3.2 | v74.07,19.86 73.91,20.02 v63.7,20.02
SPI4_MOSI  (via drill 0.3)
  Top 0.203: R62.1 56.84,22.01 56.84,22 57.76,21.08 v62.94,21.08 | v72.85,21.08 73,20.93 73,14.53 77.37,10.16 P2.4 P3.4
  Bottom 0.203: P3.4 82.6,10.11 99.57,10.11 103,13.54 121.49,13.54 126.36,18.41 126.36,46.35 115.57,57.15 113.67,57.15 P100.4 | v62.94,21.08 v72.85,21.08
SPI4_SCK  (via drill 0.3)
  Top 0.203: P3.6 P2.6 75.95,15.24 75.29,15.9 v75.29,18.8 | R38.1 55.63,19.91 56.59,18.95 v64.62,18.95
  Bottom 0.203: v75.29,18.8 75.13,18.95 v64.62,18.95 | P3.6 98.86,15.24 99.9,16.28 116.61,16.28 122.56,22.23 122.56,40.01 106.05,56.52 P100.6
SPI_CS_IMU
  Top 0.152: P100.3 113.67,59.16 112.17,57.66 87.48,57.66 81.69,51.87 56.24,51.87 52.34,47.97 IC1.90
SWCLK  (via drill 0.3)
  Top 0.203: IC1.76 59.34,41.71 60.05,42.42 62.79,42.42 v65.23,44.86
  Bottom 0.203: v65.23,44.86 66.8,46.43 66.8,61.16 67.87,62.23 J7.3
SWDIO  (via drill 0.3)
  Top 0.203: IC1.72 61.03,37.85 60.05,37.85 59.74,38.15 59.74,39.67 61.27,41.2 63.55,41.2 v64.31,41.96
  Bottom 0.203: v64.31,41.96 68.85,46.5 J7.4
TIM9_CH2  (via drill 0.3)
  Top 0.203: IC1.5 45.66,37.34 46.4,37.34 47.94,35.8 v47.94,34.14 47.94,28.57 v49.38,27.13 | v49.38,27.13 | v49.38,27.13 49.38,25.69 IC1.30 | IC1.47 57.91,25.73 57.91,26.33 57.11,27.13 v53.19,27.13 | v49.38,27.13 | IC1.78 58.37,41.1 58.37,39.35 57.27,38.25 v54.41,38.25
  Bottom 0.203: v53.19,27.13 v49.38,27.13 | v54.41,38.25 53.03,38.25 52.22,37.43 52.22,34.78 50.96,33.53 48.55,33.53 v47.94,34.14
USART3_CLK  (via drill 0.3)
  Top 0.203: v67.51,31.29 64.47,31.29 R40.1
  Bottom 0.203: v67.51,31.29 67.51,40.28 73.15,45.92 73.15,56.13 74.17,57.15 J8.1
USART3_CTS  (via drill 0.3)
  Top 0.203: IC1.58 61.84,30.89 62.67,31.72 66.42,31.72 v66.75,32.05 | P102.4 128.5,63.91 82.91,63.91 78.74,59.74 J8.2
  Bottom 0.203: v66.75,32.05 66.75,41.05 71.93,46.23 71.93,57.91 73.71,59.69 J8.2
USART3_RTS  (via drill 0.3)
  Top 0.203: IC1.59 61.84,31.4 62.59,32.15 65.73,32.15 v65.96,32.38 | J8.3 81.64,65.13 129.82,65.13 P102.3
  Bottom 0.203: v65.96,32.38 66.23,32.65 66.23,42.05 70.76,46.58 70.76,59.44 73.56,62.23 J8.3
USART3_RX  (via drill 0.3)
  Top 0.203: R6.1 64.78,30.23 65.06,30.5 68.1,30.5 v68.43,30.84 | P102.1 132.61,67.41 78.84,67.41 J8.5 75.62,64.19 75.62,56.01 v74.98,55.37
  Bottom 0.203: v68.43,30.84 68.43,39.67 74.98,46.23 v74.98,55.37
USART3_TX  (via drill 0.3)
  Top 0.203: R58.1 65.23,29.31 65.68,29.77 68.89,29.77 v69.34,30.23 | P102.2 131.27,66.22 80.19,66.22 J8.4 76.66,62.69 v76.66,55.37
  Bottom 0.203: v69.34,30.23 69.34,38.89 76.66,46.2 v76.66,55.37
V_USB  (via drill 0.3)
  Top 0.152: 22.02,46.43 U1.16
  Top 0.254: UC1.1 5.51,31.78 7.12,30.18 CP1.5 9.41,30.23 9.95,30.23 10.18,30.46 10.18,32.99 C1.2 | U1.20 20.16,46.89 19.81,47.24 C2.2
  Top 0.508: 10.13,35.03 C1.2 10.13,34.27 10.11,34.29 TP1.TP | 10.13,35.03 10.13,44.92 13.28,48.07 16.54,48.07 17.32,47.3 v17.37,47.3 19.3,47.3 C2.2 | 10.13,35.03 10.81,35.71 v11.12,35.71 | R39.2 12.14,21.59 v12.8,20.93 12.19,20.32 R25.2 | 22.02,46.43 22.07,46.48 22.94,46.48 v23.3,46.84
  Bottom 0.508: v23.3,46.84 22.84,47.3 v17.37,47.3
  pour Route15 (isolate 0.127): 7.16,37.59 7.16,20.02 13.51,20.02 13.51,37.59
VCC_1  (via drill 0.3)
  Top 0.152: C14.1 144.58,48.1 146,46.69 146,39.06 144.11,37.18 J2.4 | R28.2 47.8,11.12 48.1,10.82 49.07,10.82 49.53,11.28 49.53,13.86 Q1.1 48.43,14.96 | R30.2 52.88,11.12 53.18,10.82 54.1,10.82 54.7,11.42 54.7,13.77 Q2.1 | R34.2 42.22,11.93 42.22,13.74 Q4.1 | 38.19,14.92 37.19,13.92 37.19,11.88 R32.2 | C30.2 | IC1.50 59.4,25.6 | IC1.75 61.08,39.45 | IC1.100 47.28,41.19 | 26.96,57.93 BOOT.4
  Top 0.254: IC1.21 IC1.22 45.56,28.85 44.48,28.85 44.33,28.71 C19.2 | IC1.19 45.59,30.38 44.83,30.38 44.52,30.69 C25.2 | C24.2 44.11,34.39 IC1.11 | C30.2 45.57,36.93 IC1.6 | IC1.28 48.31,25.62 48.31,24.75 48.47,24.59 C26.2 | v53.65,16.61 53.65,15.02 Q2.1 | v48.31,16.31 48.31,15.08 48.43,14.96 | v43.28,16.31 43.28,15.03 Q4.1 | v38.25,16.46 38.31,16.4 Q3.1 38.19,14.92 | R42.2 v61.12,11.28 v61.11,11.28 | R59.2 v61.11,13.87
  Top 0.508: R57.2 59.89,60.91 v59.99,61.01 | v47.19,56.74 R56.2 | JP1.3 v33.83,27.79 | v28.3,56.59 26.96,57.93 | 32.61,44.04 33.73,44.04 v33.83,43.94 | R47.2 32.61,44.04 | 32.62,46.45 TP2.TP 32.7,44.12 32.61,44.04 | v24.23,28.7 24.28,28.66 C32.1 20.42,26.84 L1.1 | R24.2 13.06,19.05 v15.7,21.69 | v142.8,48.06 142.84,48.1 C14.1 | R19.2 140.87,48.97 v140.36,48.97 140.31,48.92 R13.2 | R12.2 v142.65,29.46 | R1.2 v140.51,29.62 | v63.55,39.98 C28.2 61.62,39.98 61.08,39.45 | v47.09,43.64 v47.09,43.63 C29.2 47.09,41.38 47.28,41.19 47.28,41.13 | v42.82,38.3 C23.2 42.98,36.93 C30.2 | v43.16,34.8 43.33,34.8 43.69,34.44 C24.2 | v43.2,30.68 v43.21,30.69 C25.2 | v42.06,28.7 v42.07,28.71 C18.2 C19.2 | C26.2 v48.47,23.22 v48.46,23.22 | v60.2,23.22 C27.2 | C27.2 | C27.2 60.2,24.8 59.4,25.6 59.4,25.65 | v134.42,50.8 134.47,50.75 R20.2 | BOOT.4 BOOT.3
  Bottom 0.152: MUX1.1 83.76,23.01
  Bottom 0.254: U5.3 U5.4 102.35,36.03 102.48,36.17 103.12,36.34 103.79,36.34 C4.2 104.46,35.67 v105.16,35.36 | U7.3 U7.4 114.17,34.66 114.35,34.36 114.2,33.81 113.52,33.13 C5.2 v112.17,32.66 | U3.3 U3.4 106.97,24.61 106.36,25.21 106.36,26.41 | C7.2 106.36,26.41 | U6.4 113.37,27.59 113,27.22 112.78,27.16 112.74,27.13 112.35,27.13 C6.2 v110.8,28.25 | U4.4 108.93,38.9 109.69,38.13 109.69,37.18 C3.2 109.78,36.28 v109.73,36.27 | U8.4 101.67,28.82 101.53,29.07 101.7,29.69 102.49,30.47 C8.2 v103.63,30.99 | v106.38,27.33 106.36,26.41
  Bottom 0.508: R8.2 128.93,50.95 | 128.93,50.95 R2.2 | 128.93,50.95 v128.93,51.87 | v84.07,23.55 84.07,23.33 83.76,23.01 | U$1.5 77.72,43.21 v77.72,42.42
  pour Route15 (isolate 0.127): 27.58,72.24 27.58,28.65 14.94,28.65 14.94,21.03 35.81,21.03 35.81,13.87 61.26,13.87 61.26,-1.52 136.55,-1.52 136.55,14.43 149.56,14.43 149.56,57.15 134.01,57.15 134.01,72.24
VCC_2  (via drill 0.3)
  Top 0.508: JP4.3 7.44,42.19 v7.44,43.48 | v10.39,52.32 7.64,52.32 JST_BAT.2 | U2.6 16.96,55.31 v16.97,55.3 | R49.2 12.8,45.28 | 12.8,45.28 12.22,45.28 v12.19,45.31 | TP3.TP 12.76,45.24 12.8,45.28
  pour Route15 (isolate 0.127): 3.81,41.5 25.4,41.5 25.4,57.71 3.81,57.71
VOUT  (via drill 0.3)
  Top 0.508: R48.2 28.04,20.49 28.04,19.1 | 28.04,19.1 v28.04,17.88 | TP4.TP 30.27,19.1 28.04,19.1 | R16.2 v10.69,6.17 | v16.31,6.17 R15.2 | R11.2 v30.18,7.37 | R14.2 v36.58,7.37 | R33.2 41.51,10.97 v41.6,10.87 | R35.2 v45.72,9.96 | R29.2 50.96,10.97 v51.82,10.11 | R31.2 55.93,10.92 v55.93,9.96
  pour Route15 (isolate 0.127): 33.02,19.05 23.52,19.05 23.52,9.25 9.7,9.25 9.7,-1.68 56.79,-1.68 56.79,11.63 33.02,11.63
VOUT2
  Top 0.152: 27.67,44.25 C41.2 | U1.11
  Top 0.254: R43.2 23.55,44.17 U1.11
  Top 0.508: R43.2 R45.2 27.67,44.25 | C41.2 29.49,44.17 R47.1

## Text on the board
tPlace: Designed by: Rahul Subramonian Bama | GND | RST | GND | RX | iGlobus Evaluation Board V1.0 | PB9 | GND | VCC | TX | GND | CLK | PWR | PWR | RTS | PC10 | DIO | CTS | GPIO | SWD | CLK | USART | MTi-7 Shield | SPI1 | SPI2 | I2C1 | I2C2 | MOTOR / DRIVER | SCL | SCL | DIR | SDA | SDA | PWM | VCC | VCC | VCC | VCC | GND | GND | GND | GND | GND
bPlace: IMU PSEL | GND | GND | Hall Sensor | Microphone Array | GND